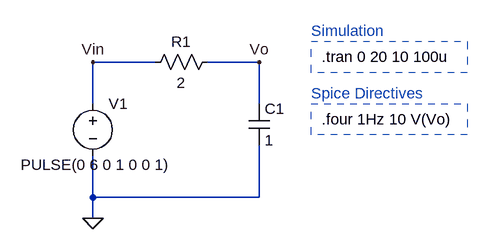
[diagram p0: schematic Other_Example_2.asc]
Other_Example_2.asc, the LTspice schematic file:
Version 4
SHEET 1 1900 680
WIRE 720 32 624 32
WIRE 880 32 800 32
WIRE 624 96 624 32
WIRE 880 96 880 32
WIRE 624 240 624 176
WIRE 880 240 880 160
WIRE 880 240 624 240
WIRE 624 272 624 240
FLAG 624 272 0
FLAG 880 32 Vo
FLAG 624 32 Vin
SYMBOL voltage 624 80 R0
WINDOW 3 -111 110 Left 2
WINDOW 123 24 124 Left 2
WINDOW 39 0 0 Left 0
SYMATTR Value PULSE(0 6 0 1 0 0 1)
SYMATTR InstName V1
SYMBOL res 816 16 R90
WINDOW 0 0 56 VBottom 2
WINDOW 3 32 56 VTop 2
SYMATTR InstName R1
SYMATTR Value 2
SYMBOL cap 864 96 R0
SYMATTR InstName C1
SYMATTR Value 1
TEXT 976 24 Left 2 !.tran 0 20 10 100u
TEXT 976 120 Left 2 !.four 1Hz 10 V(Vo)
TEXT 960 -16 Left 2 ;Simulation
TEXT 960 80 Left 2 ;Spice Directives
RECTANGLE Normal 1200 48 960 0 2
RECTANGLE Normal 1200 144 960 96 2

The netlist it stands for:
* Other_Example_2.asc
V1 Vin 0 PULSE(0 6 0 1 0 0 1)
R1 Vo Vin 2
C1 Vo 0 1
.tran 0 20 10 100u
.four 1Hz 10 V(Vo)
* Simulation
* Spice Directives
.backanno
.end